# EAGLE design CAN-DW (EAGLE 5.04)
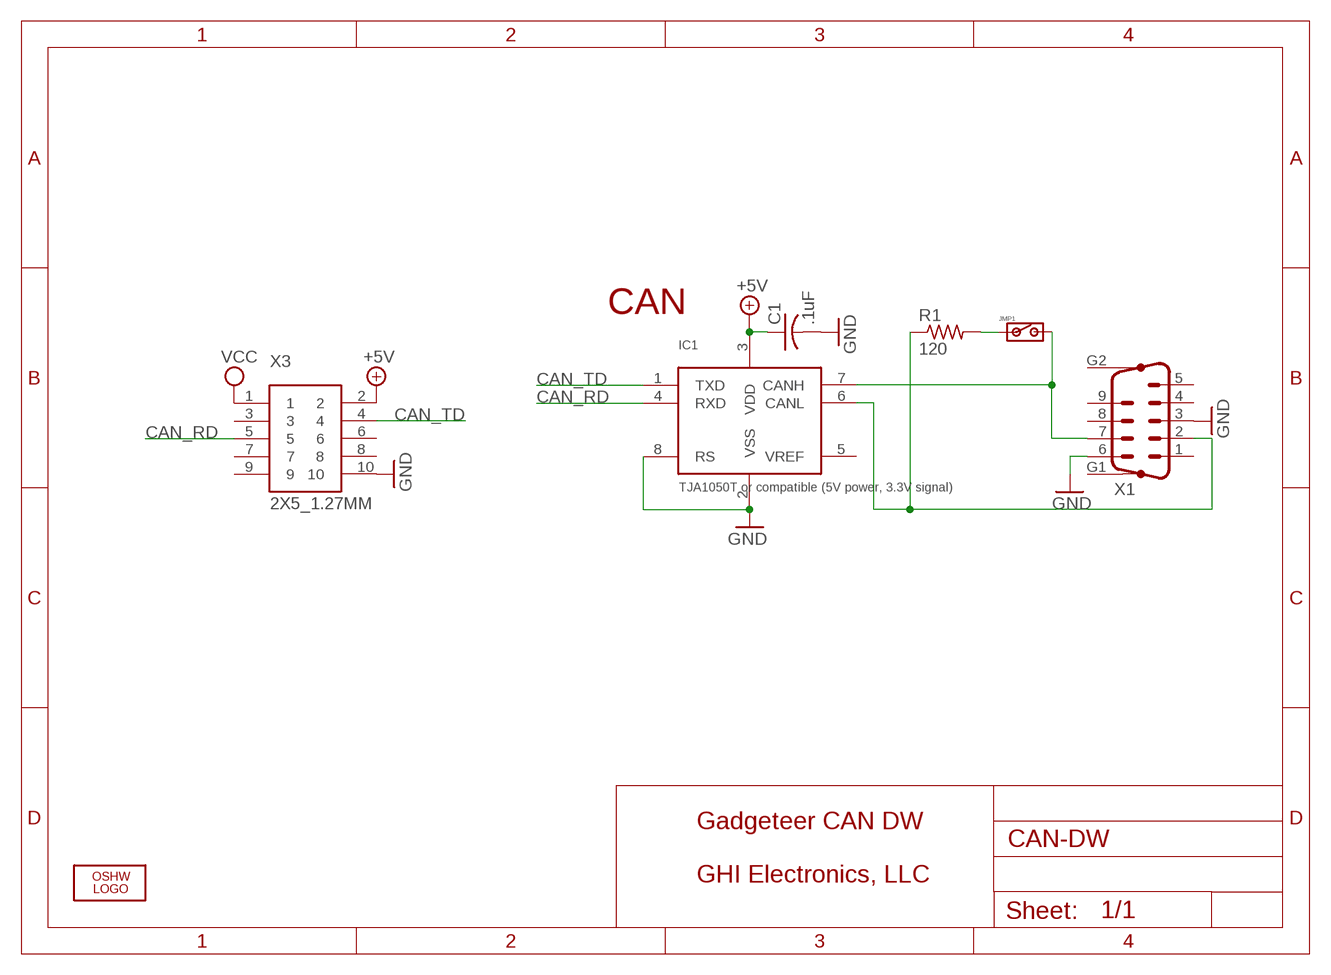
[diagram p0: schematic, sheet 1]

## Parts
C1  .1uF  C-USC0603  [C0603]
IC1  TJA1050T or compatible (5V power, 3.3V signal)  MCP2551  [SO8]
JMP1  do nto connect  JP_SW  [JP_SW]
LOGO2  LOGO-OSHW-FILLX0200-NT  [OSHW_FILLX200_NOTEXT]
R1  120  R-US_R0603  [R0603]
X1  M09HP  [M09HP]
X3  2X5_1.27MM  [2X5_1.27MM]

## Nets
+5V [power]: C1.1 IC1.3(VDD) X3.2
CAN_RD: IC1.4(RXD) X3.5
CAN_TD: IC1.1(TXD) X3.4
GND [power]: C1.2 IC1.2(VSS) IC1.8(RS) X1.3 X1.6 X3.10
HS1_L1: IC1.6(CANL) R1.1 X1.2
N$20: IC1.7(CANH) JMP1.2 X1.7
N$21: JMP1.1 R1.2
VCC [power]: X3.1
Unconnected: IC1.5(VREF) X1.1 X1.4 X1.5 X1.8 X1.9 X1.G1 X1.G2 X3.3 X3.6 X3.7 X3.8 X3.9

## Notes on the sheet
- CAN
- Gadgeteer CAN DW
- GHI Electronics, LLC

## Library data of the parts
C1 = rcl:C-US: CAPACITOR, American symbol
IC1 = GHI:MCP2551
JMP1 = CPT_SMD:JP_SW
LOGO2 = Logo:LOGO-OSHW-FILL
R1 = rcl:R-US_: RESISTOR, American symbol
X1 = con-subd:M09HP: SUB-D
X3 = GHI:2X5_1.27MM

## Net classes
0 default: width 0.254 mm, drill 0.381 mm, clearance 0.203 mm

## Board
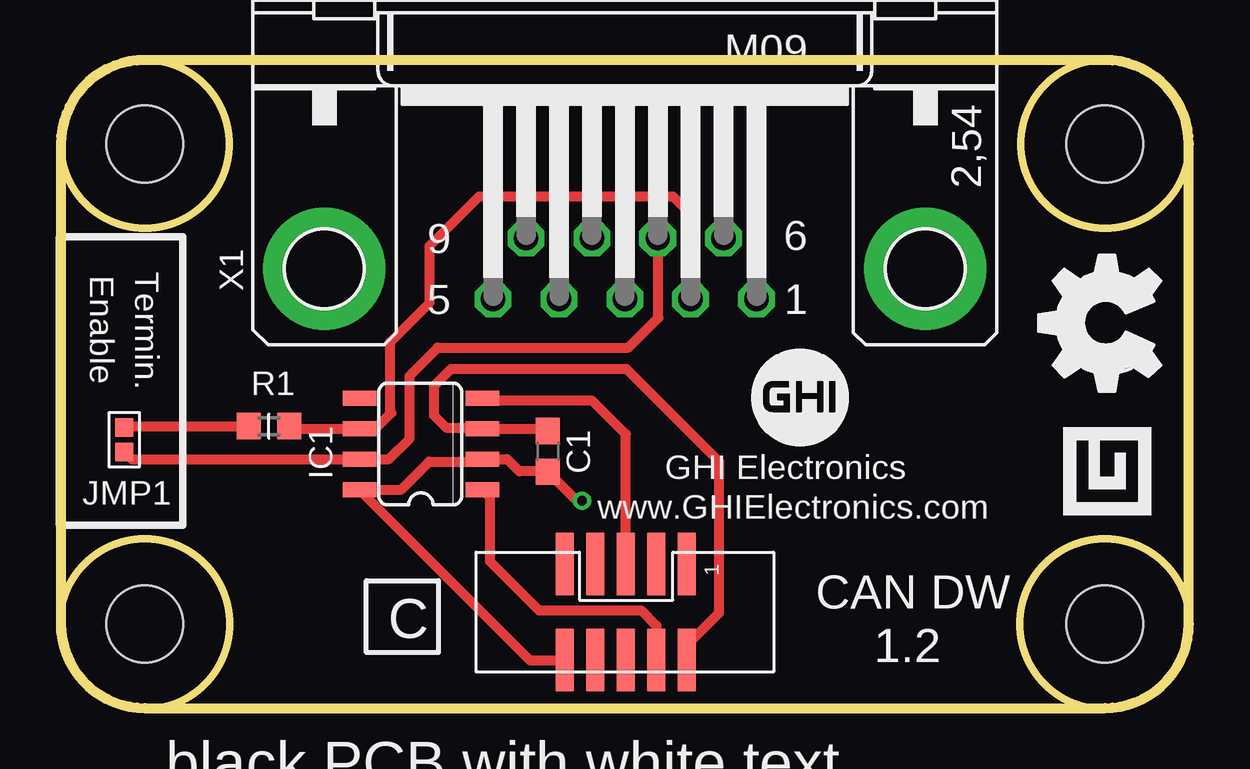
[diagram p1: board, top side]
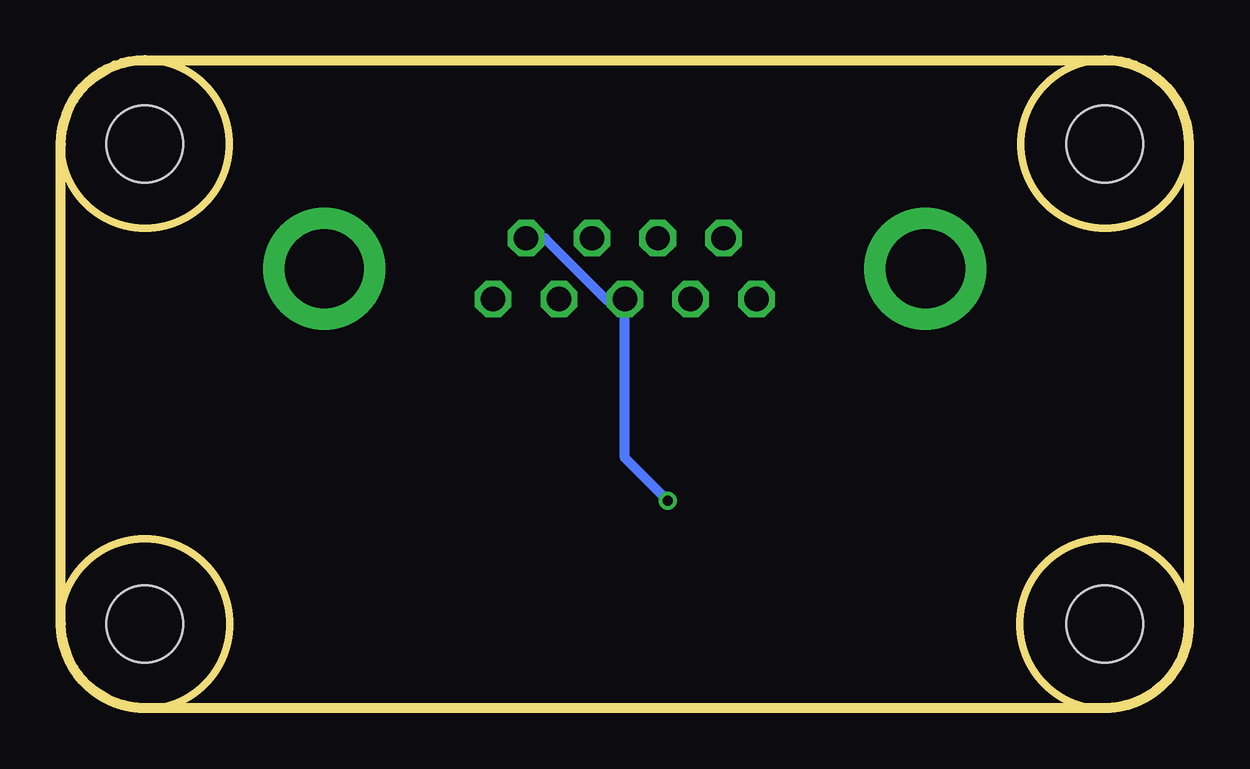
[diagram p2: board, bottom side, seen from below]

Size 47.07 x 27.04 mm. Coordinates in mm from the lower left corner, seen from the top.
Outline: 43.54,0.04 arc90 47.04,3.54 47.04,23.54 arc90 43.54,27.04 3.54,27.04 arc90 0.04,23.54 0.04,3.54 arc90 3.54,0.04 43.54,0.04
Outline: circle at 3.54,23.54 radius 3.5
Outline: circle at 43.54,23.54 radius 3.5
Outline: circle at 43.54,3.54 radius 3.54
Outline: circle at 3.54,3.54 radius 3.54
Copper layers (1+16): Top 0.035mm / dielectric 1.5mm / Bottom 0.035mm
Design rules "default *": minimum track width 8mil, minimum drill 12mil, track to track 8mil, track to pad 8mil, pad to pad 8mil, via to via 8mil, smd to smd 8mil, copper to edge 15mil, drill to drill 8mil, minimum pad ring 10mil, minimum via ring 7mil, stop-mask expansion 4mil, vias tented up to drill 50mil, thermal gap 10mil
Holes 3.2 mm at 3.54,3.54 43.54,23.54 3.54,23.54 43.54,3.54

### Footprints (pad centres in the part's own frame; a part is rotated, then mirrored left to right if it is on the bottom)
C0603 = smd 1.1 x 1: 1 -0.85,0; 2 0.85,0
SO8 = smd 0.635 x 1.397: 1 -1.905,-2.565; 2 -0.635,-2.565; 3 0.635,-2.565; 4 1.905,-2.565; 5 1.905,2.565; 6 0.635,2.565; 7 -0.635,2.565; 8 -1.905,2.565
JP_SW = smd 0.762 x 0.762: 1 0,0.508; 2 0,-0.508
R0603 = smd 1 x 1.1: 1 -0.85,0; 2 0.85,0
M09HP = drill 1.016 octagon: 1 -5.486,1.27; 2 -2.743,1.27; 3 0,1.27; 4 2.743,1.27; 5 5.486,1.27; 6 -4.115,-1.27; 7 -1.372,-1.27; 8 1.372,-1.27; 9 4.115,-1.27 | drill 3.302 pad 5.08 round: G1 -12.522,0; G2 12.522,0
2X5_1.27MM = smd 2.6 x 0.74: 1 -2,2.58; 2 2,2.58; 3 -2,1.31; 4 2,1.31; 5 -2,0.04; 6 2,0.04; 7 -2,-1.23; 8 2,-1.23; 9 -2,-2.5; 10 2,-2.5

### Placement (x,y rotation side)
C1  20.32,10.73 270 top
IC1  15.04,11.04 90 top
JMP1  2.68,11.21 0 top
LOGO2  45.86,13.24 90 top
R1  8.71,11.78 180 top
X1  23.54,18.34 180 top
X3  23.54,4.04 270 top

### Tracks (layer width: path | path; a pad name or v marks a point on that pad's centre or on a via)
+5V
  Top 0.406: C1.1 20.23,11.67 IC1.3 17.55,11.72 16.09,11.72 15.58,12.23 15.58,13.45 16.29,14.16 23.61,14.16 27.47,10.3 27.47,4 26.12,2.65 X3.2
CAN_RD
  Top 0.406: X3.5 23.58,11.45 22.18,12.84 17.7,12.84 IC1.4
CAN_TD
  Top 0.406: X3.4 24.85,3.47 24.22,4.1 19.95,4.1 17.92,6.13 17.92,8.81 IC1.1
GND  (via drill 0.41)
  Top 0.406: X3.10 19.57,2.04 IC1.8 14.21,9.13 15.38,10.3 17.5,10.3 IC1.2 18.63,10.4 19.14,9.89 C1.2 21.53,8.67 v21.75,8.67
  Bottom 0.406: X1.6 26.87,19.61 24.24,16.98 23.62,16.68 X1.3 23.54,10.45 v21.75,8.67
HS1_L1
  Top 0.406: R1.1 9.66,11.67 IC1.6 13.14,11.67 13.8,12.33 13.75,12.38 13.75,15.28 15.4,16.93 15.4,19.3 17.46,21.35 25.54,21.35 26.28,20.61 X1.2
N$20
  Top 0.406: X1.7 24.93,19.29 24.93,16.29 23.68,15.05 15.73,15.05 14.56,13.88 14.56,11.26 13.7,10.4 IC1.7 2.98,10.4 JMP1.2
N$21
  Top 0.406: R1.2 2.68,11.78 JMP1.1

### Text on the board
tPlace: Enable | Termin. | GHI Electronics | www.GHIElectronics.com | CAN DW | C | 1.2 | black PCB with white text | corner holes are nonplated | do not add manufacturing codes